# Altium project old_singleboard_now_mcu.PrjPcb (part 3 of 4)

## Sheet power.SchDoc
size 381 x 241 mm; SheetNumber: 2; SheetTotal: 5
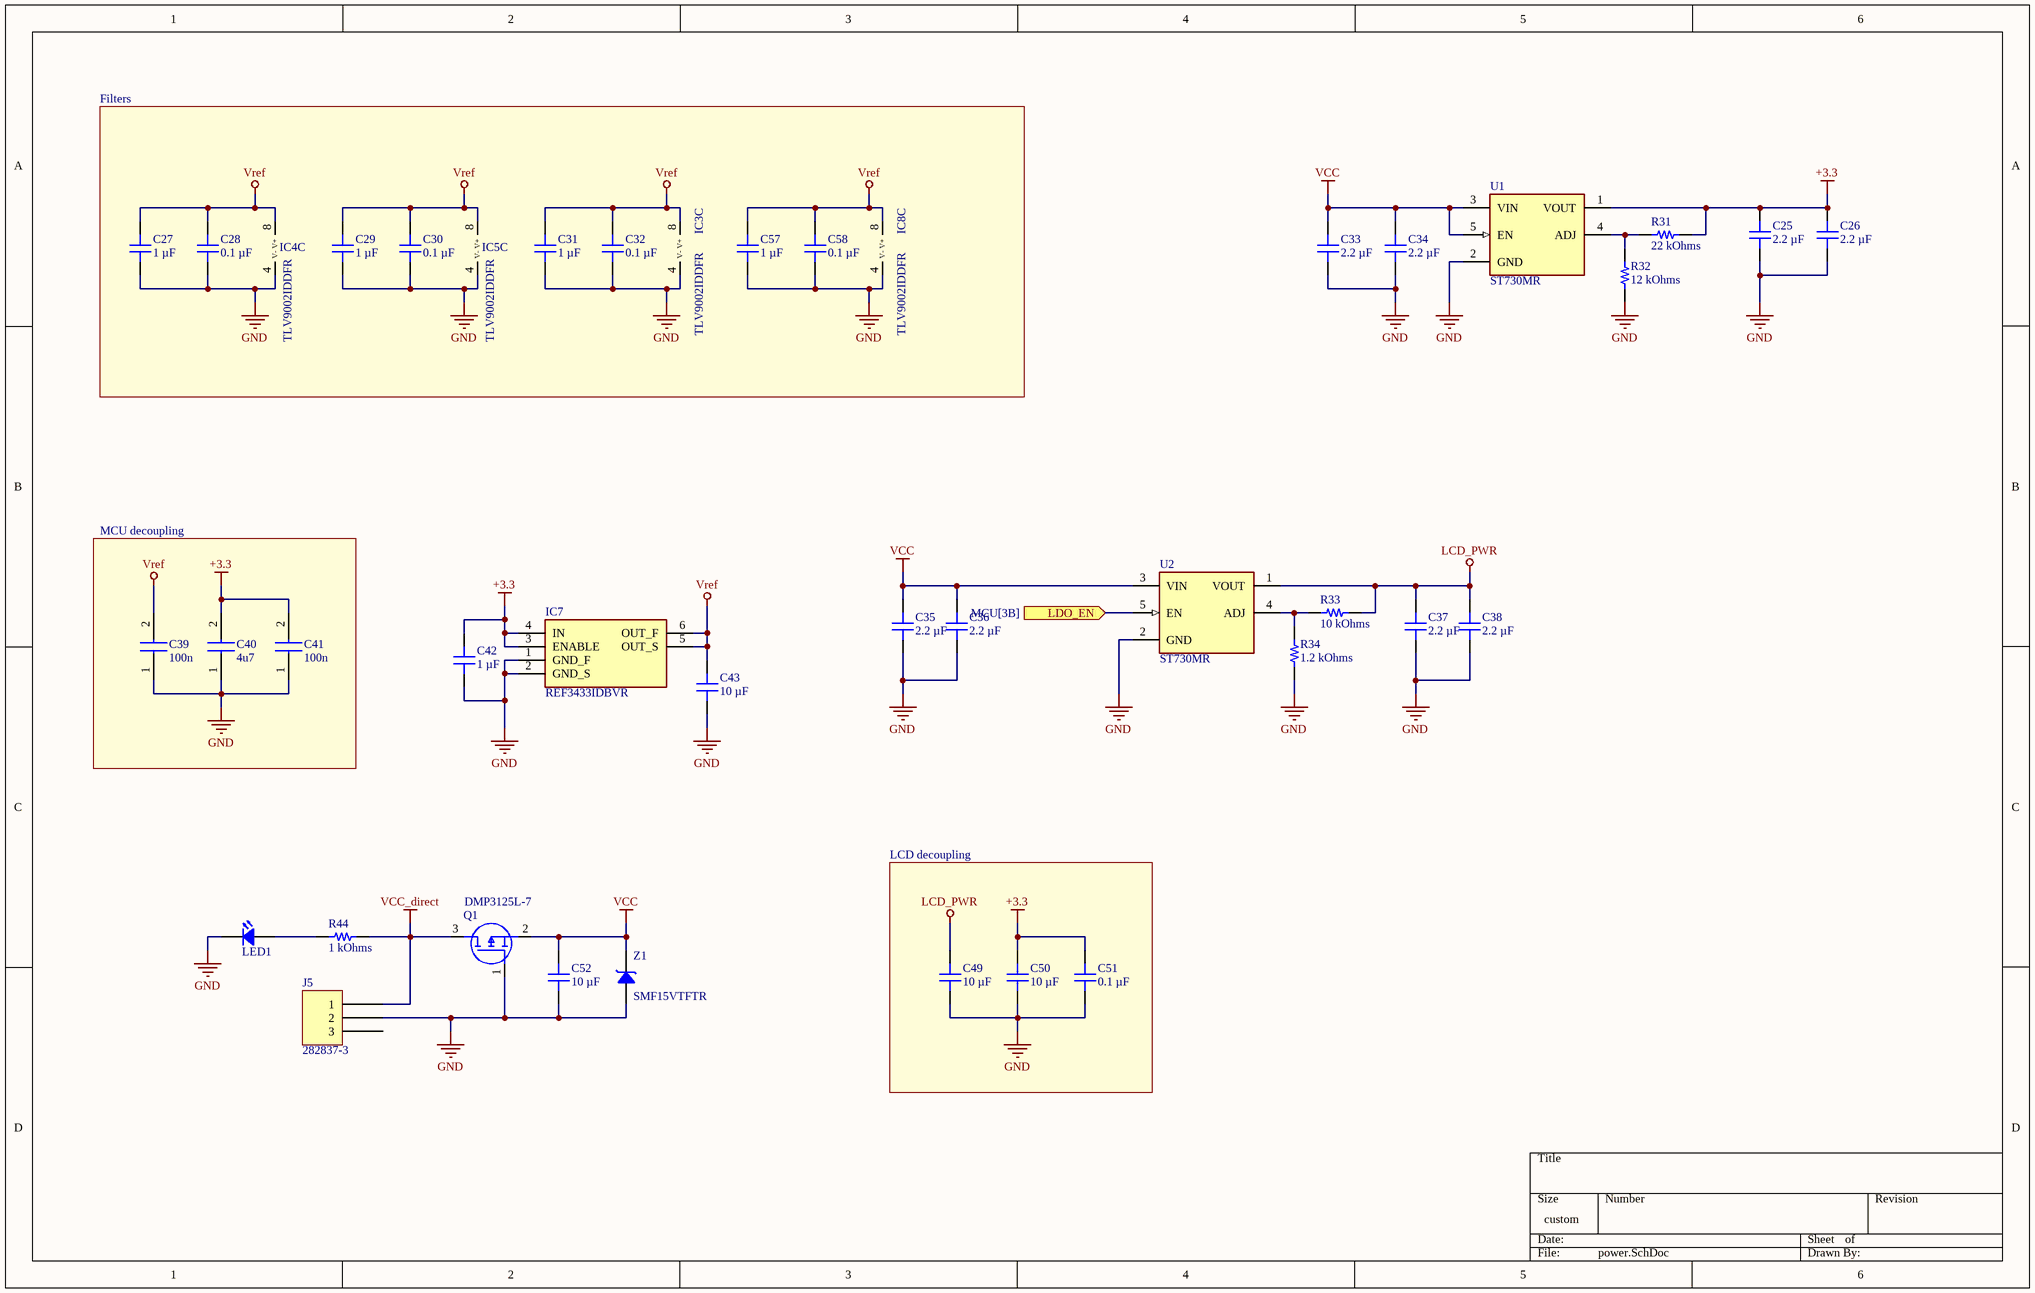
[diagram p5: power.SchDoc]

### Parts
(Parts that share a designator on the sheet are numbered #1, #2 ... from top to bottom, then left to right.)
C25#1  2.2 µF  [CAP 1206_3216 - 0.8MM]
C26#1  2.2 µF  [CAP 1206_3216 - 0.8MM]
C27#1  1 µF  [CAP 1206_3216 - 0.8MM]
C28#1  0.1 µF  [CAP 1206_3216 - 0.8MM]
C29#1  1 µF  [CAP 1206_3216 - 0.8MM]
C30#1  0.1 µF  [CAP 1206_3216 - 0.8MM]
C31#1  1 µF  [CAP 1206_3216 - 0.8MM]
C32#1  0.1 µF  [CAP 1206_3216 - 0.8MM]
C33#1  2.2 µF  [CAP 1206_3216 - 0.8MM]
C34#1  2.2 µF  [CAP 1206_3216 - 0.8MM]
C35#1  2.2 µF  [CAP 1206_3216 - 0.8MM]
C36#1  2.2 µF  [CAP 1206_3216 - 0.8MM]
C37#1  2.2 µF  [CAP 1206_3216 - 0.8MM]
C38#1  2.2 µF  [CAP 1206_3216 - 0.8MM]
C39  100n  [C0805]
C40  4u7  [C0805]
C41  100n  [C0805]
C42  1 µF  [CAP 1206_3216 - 0.8MM]
C43  10 µF  [CAP 1206_3216 - 0.8MM]
C49  10 µF  [CAP 1206_3216 - 0.8MM]
C50  10 µF  [CAP 1206_3216 - 0.8MM]
C51  0.1 µF  [CAP 1206_3216 - 0.8MM]
C52  10 µF  [CAP 1206_3216 - 0.8MM]
C57  1 µF  [CAP 1206_3216 - 0.8MM]
C58  0.1 µF  [CAP 1206_3216 - 0.8MM]
IC3  TLV9002IDDFR  [SOT65P280X110-8N]  (part C of 3)
IC4  TLV9002IDDFR  [SOT65P280X110-8N]  (part C of 3)
IC5  TLV9002IDDFR  [SOT65P280X110-8N]  (part C of 3)
IC7  REF3433IDBVR  [SOT95P280X145-6N]
IC8  TLV9002IDDFR  [SOT65P280X110-8N]  (part C of 3)
J5#2  282837-3  [TE 282837-3]
LED1  KR_EELP41.22-Q1S1-36-A8J8-020-R18  [KREELP4122Q1S136A8J8020R18]  (value not drawn)
Q1#2  DMP3125L-7  [SOT96P240X110-3N]
R31#2  22 kOhms  [YAGEO RES 1206_3216]
R32#2  12 kOhms  [YAGEO RES 1206_3216]
R33#2  10 kOhms  [YAGEO RES 1206_3216]
R34#2  1.2 kOhms  [YAGEO RES 1206_3216]
R44#2  1 kOhms  [YAGEO RES 1206_3216]
U1#2  ST730MR  [FP-UJ-5-IPC_B]
U2#2  ST730MR  [FP-UJ-5-IPC_B]
Z1  SMF15VTFTR  [SMF15VTFTR]

### Blocks framed on the sheet
Filters: C27#1 C28#1 C29#1 C30#1 C31#1 C32#1 C57 C58 IC3-IC5 IC8
MCU decoupling: C39-C41
LCD decoupling: C49-C51

### Ports
LDO_EN (in, see MCU[3B])

### Nets
+3.3: C25#1.2 C26#1.2 C40.2 C41.2 C42.2 C50.2 C51.2 IC7.3(ENABLE) IC7.4(IN) R31#2.2 U1#2.1(VOUT)
GND: C25#1.1 C26#1.1 C27#1.1 C28#1.1 C29#1.1 C30#1.1 C31#1.1 C32#1.1 C33#1.1 C34#1.1 C35#1.1 C36#1.1 C37#1.1 C38#1.1 C39.1 C40.1 C41.1 C42.1 C43.1 C49.1 C50.1 C51.1 C52.1 C57.1 C58.1 IC3.4(V-) IC4.4(V-) IC5.4(V-) IC7.1(GND_F) IC7.2(GND_S) IC8.4(V-) J5#2.2 LED1.1(K) Q1#2.1(G) R32#2.2 R34#2.2 U1#2.2(GND) U2#2.2(GND) Z1.2
LCD_PWR: C37#1.2 C38#1.2 C49.2 R33#2.2 U2#2.1(VOUT)
VCC: C33#1.2 C34#1.2 C35#1.2 C36#1.2 C52.2 Q1#2.2(S) U1#2.3(VIN) U1#2.5(EN) U2#2.3(VIN) Z1.1
VCC_direct: J5#2.1 Q1#2.3(D) R44#2.1
Vref: C27#1.2 C28#1.2 C29#1.2 C30#1.2 C31#1.2 C32#1.2 C39.2 C43.2 C57.2 C58.2 IC3.8(V+) IC4.8(V+) IC5.8(V+) IC7.5(OUT_S) IC7.6(OUT_F) IC8.8(V+)
LDO_EN: U2#2.5(EN) ; port LDO_EN
NetLED1_2: LED1.2(A) R44#2.2
NetR31#2_1: R31#2.1 R32#2.1 U1#2.4(ADJ)
NetR33#2_1: R33#2.1 R34#2.1 U2#2.4(ADJ)

Not connected (* = marked no-connect by the designer): J5#2 3

### Library data of the parts
C25#1 C26#1 C33#1 C34#1 C35#1 C36#1 C37#1 C38#1 = 885382208001: CAP CER 2.2UF 25V X7R 1206; manufacturer: Würth Elektronik; Tolerance: ±10%; Part Number: 885382208001; Capacitance: 2.2 µF; Applications: Boardflex Sensitive; componentlink2description: DigiKey Link; componentlink2url: https://www.digikey.com/en/products/detail/würth-elektronik/885382208001/9816354; Device Package: 1206 (3216 Metric); Features: Soft Termination; lastupdated: 6/4/2024 19:10:38; Lifecycle Status: Active; Minimum Order: 1; Mounting Type: Surface Mount, MLCC; Operating Temperature: -55°C ~ 125°C; Package / Case: 1206 (3216 Metric); packaging: TapeAndReel; partid: 45904; Part Status: Active; price: 0.35; series: WCAP-CSST; Size / Dimension: 0.126" L x 0.063" W (3.20mm x 1.60mm); Supplier 1: DigiKey; Supplier Part Number 1: 732-13199-1-ND; Temperature Coefficient: X7R; Thickness (Max): 0.083" (2.10mm); value: 2.2 µF; Voltage - Rated: 25V
C27#1 C29#1 C31#1 C42 C57 = 885012208093: CAP CER 1UF 50V X7R 1206; manufacturer: Würth Elektronik; Tolerance: ±10%; Part Number: 885012208093; Capacitance: 1 µF; Applications: General Purpose; componentlink1description: Datasheet; componentlink1url: https://katalog.we-online.de/pbs/datasheet/885012208093.pdf; componentlink2description: DigiKey Link; componentlink2url: https://www.digikey.com/en/products/detail/würth-elektronik/885012208093/5453432; Device Package: 1206 (3216 Metric); lastupdated: 6/4/2024 19:10:33; Lifecycle Status: Active; Minimum Order: 1; Mounting Type: Surface Mount, MLCC; Operating Temperature: -55°C ~ 125°C; Package / Case: 1206 (3216 Metric); packaging: TapeAndReel; partid: 39665; Part Status: Active; price: 0.10; series: WCAP-CSGP; Size / Dimension: 0.126" L x 0.063" W (3.20mm x 1.60mm); Supplier 1: DigiKey; Supplier Part Number 1: 732-7577-1-ND; Temperature Coefficient: X7R; Thickness (Max): 0.075" (1.90mm); value: 1 µF; Voltage - Rated: 50V
C28#1 C30#1 C32#1 C51 C58 = 885012208087: CAP CER 0.1UF 50V X7R 1206; manufacturer: Würth Elektronik; Tolerance: ±10%; Part Number: 885012208087; Capacitance: 0.1 µF; Applications: General Purpose; componentlink1description: Datasheet; componentlink1url: https://katalog.we-online.de/pbs/datasheet/885012208087.pdf; componentlink2description: DigiKey Link; componentlink2url: https://www.digikey.com/en/products/detail/würth-elektronik/885012208087/5453982; Device Package: 1206 (3216 Metric); lastupdated: 6/4/2024 19:10:27; Lifecycle Status: Active; Minimum Order: 1; Mounting Type: Surface Mount, MLCC; Operating Temperature: -55°C ~ 125°C; Package / Case: 1206 (3216 Metric); packaging: TapeAndReel; partid: 20879; Part Status: Active; price: 0.06; series: WCAP-CSGP; Size / Dimension: 0.126" L x 0.063" W (3.20mm x 1.60mm); Supplier 1: DigiKey; Supplier Part Number 1: 732-8127-1-ND; Temperature Coefficient: X7R; Thickness (Max): 0.035" (0.90mm); value: 0.1 µF; Voltage - Rated: 50V
C39 C41 = C0805C104K3RACTU: Capacitor; Manufacturer_Name: KEMET; Datasheet Link: https://content.kemet.com/datasheets/KEM_C1002_X7R_SMD.pdf; Height: 1.1mm; Manufacturer_Part_Number: C0805C104K3RACTU; Mouser Part Number: 80-C0805C104K3R; Mouser Price/Stock: https://www.mouser.co.uk/ProductDetail/KEMET/C0805C104K3RACTU?qs=zZwvocWqSRjmUvfNxkIN%2Fg%3D%3D; Arrow Part Number: C0805C104K3RACTU; Arrow Price/Stock: https://www.arrow.com/en/products/c0805c104k3ractu/kemet-corporation
C40 = C0805C475K9PAC: Capacitor; Manufacturer_Name: KEMET; Datasheet Link: https://componentsearchengine.com/Datasheets/2/C0805C475K8RACTU.pdf; Height: 1.4mm; Manufacturer_Part_Number: C0805C475K9PAC; Mouser Part Number: 80-C0805C475K9PAC; Mouser Price/Stock: https://www.mouser.co.uk/ProductDetail/KEMET/C0805C475K9PAC?qs=AHS6Mz2dKxNT7foClPNFpA%3D%3D; Arrow Part Number: C0805C475K9PAC; Arrow Price/Stock: https://www.arrow.com/en/products/c0805c475k9pac/kemet-corporation?region=nac
C43 C49 C50 C52 = 885012208069: CAP CER 10UF 25V X7R 1206; manufacturer: Würth Elektronik; Tolerance: ±10%; Part Number: 885012208069; Capacitance: 10 µF; Applications: General Purpose; componentlink1description: Datasheet; componentlink1url: https://katalog.we-online.de/pbs/datasheet/885012208069.pdf; componentlink2description: DigiKey Link; componentlink2url: https://www.digikey.com/en/products/detail/würth-elektronik/885012208069/5453429; Device Package: 1206 (3216 Metric); lastupdated: 6/4/2024 19:10:32; Lifecycle Status: Active; Minimum Order: 1; Mounting Type: Surface Mount, MLCC; Operating Temperature: -55°C ~ 125°C; Package / Case: 1206 (3216 Metric); packaging: TapeAndReel; partid: 43199; Part Status: Active; price: 0.40; series: WCAP-CSGP; Size / Dimension: 0.126" L x 0.063" W (3.20mm x 1.60mm); Supplier 1: DigiKey; Supplier Part Number 1: 732-7574-1-ND; Temperature Coefficient: X7R; Thickness (Max): 0.075" (1.90mm); value: 10 µF; Voltage - Rated: 25V
IC3-IC5 IC8 = TLV9002IDDFR: Integrated Circuit; Manufacturer_Name: Texas Instruments; Datasheet Link: https://www.ti.com/lit/gpn/TLV9002; Height: 1.1mm; Manufacturer_Part_Number: TLV9002IDDFR; Mouser Part Number: 595-TLV9002IDDFR; Mouser Price/Stock: https://www.mouser.co.uk/ProductDetail/Texas-Instruments/TLV9002IDDFR?qs=mAH9sUMRCtuVJ6NmNV%252Bgrw%3D%3D; Arrow Part Number: TLV9002IDDFR; Arrow Price/Stock: https://www.arrow.com/en/products/tlv9002iddfr/texas-instruments?utm_currency=USD&region=nac
IC7 = REF3433IDBVR: Integrated Circuit; Manufacturer_Name: Texas Instruments; Datasheet Link: http://www.ti.com/lit/ds/symlink/ref3433.pdf; Height: 1.45mm; Manufacturer_Part_Number: REF3433IDBVR; Mouser Part Number: 595-REF3433IDBVR; Mouser Price/Stock: https://www.mouser.co.uk/ProductDetail/Texas-Instruments/REF3433IDBVR?qs=W0yvOO0ixfGBJPqcMgjPbw%3D%3D; Arrow Part Number: REF3433IDBVR; Arrow Price/Stock: https://www.arrow.com/en/products/ref3433idbvr/texas-instruments?utm_currency=USD&region=nac
J5#2 = 282837-3: TERM BLK 3P SIDE ENT 5.08MM PCB; Manufacturer: TE Connectivity AMP Connectors; Current: 13.5 A; Mating Orientation: Horizontal with Board; Number of Levels: 1; Pitch: 0.200" (5.08mm); Positions Per Level: 3; Voltage: 300 V; Wire Gauge: 16-28 AWG; Wire Termination: Screw - Rising Cage Clamp; Part Number: 282837-3; Color: Green; ComponentLink1Description: Datasheet; ComponentLink1URL: https://www.te.com/commerce/DocumentDelivery/DDEController?Action=srchrtrv&DocNm=282837&DocType=Customer+Drawing&DocLang=English; ComponentLink2Description: DigiKey Link; ComponentLink2URL: https://www.digikey.com/en/products/detail/te-connectivity-amp-connectors/282837-3/2187974; Features: Interlocking (Side); LastUpdated: 6/21/2022 15:00:39; Lifecycle Status: Active; Minimum Order: 1; Mounting Type: Through Hole; Packaging: Tray; Part Status: Active; Price: 0.47; Series: Buchanan; Supplier 1: DigiKey; Supplier Part Number 1: A113321-ND
LED1 = KR_EELP41.22-Q1S1-36-A8J8-020-R18: LED; Manufacturer_Name: ams OSRAM; Manufacturer_Part_Number: KR EELP41.22-Q1S1-36-A8J8-020-R18; Datasheet Link: https://look.ams-osram.com/m/7eda7e8e2ca21691/original/KR-EELP41-22.pdf; Height: 0.5mm; Mouser Part Number: 720-P412Q1S136A8J802; Mouser Price/Stock: https://www.mouser.co.uk/ProductDetail/ams-OSRAM/KR-EELP41.22-Q1S1-36-A8J8-020-R18?qs=ZcfC38r4PouTxNZSRl%252Bn6g%3D%3D
Q1#2 = DMP3125L-7: MOSFET (P-Channel); Manufacturer_Name: Diodes Incorporated; Datasheet Link: https://www.diodes.com//assets/Datasheets/DMP3125L.pdf; Height: 1.1mm; Manufacturer_Part_Number: DMP3125L-7; Mouser Part Number: 621-DMP3125L-7; Mouser Price/Stock: https://www.mouser.co.uk/ProductDetail/Diodes-Incorporated/DMP3125L-7?qs=W0yvOO0ixfH8ma8MdHfXQA%3D%3D; Arrow Part Number: DMP3125L-7; Arrow Price/Stock: https://www.arrow.com/en/products/dmp3125l-7/diodes-incorporated?region=nac
R31#2 = RT1206FRE0722KL: RES SMD 22K OHM 1% 1/4W 1206; Manufacturer: Yageo; Power (Watts): 0.25W, 1/4W; Temperature Coefficient: ±50ppm/°C; Part Number: RT1206FRE0722KL; ComponentLink1Description: Datasheet; ComponentLink1URL: https://www.yageo.com/upload/media/product/productsearch/datasheet/rchip/PYu-RT_1-to-0.01_RoHS_L_12.pdf; ComponentLink2Description: DigiKey Link; ComponentLink2URL: https://www.digikey.com/en/products/detail/yageo/RT1206FRE0722KL/1083042; Composition: Thin Film; Device Package: 1206 (3216 Metric); Height - Seated (Max): 0.026" (0.65mm); LastUpdated: 7/25/2024 09:21:19; Lifecycle Status: Active; Minimum Order: 1; Number of Terminations: 2; Operating Temperature: -55°C ~ 155°C; Package / Case: 1206 (3216 Metric); Packaging: TapeAndReel; PartId: 69172; Price: 0.01; Resistance: 22 kOhms; Series: RT; Size / Dimension: 0.122" L x 0.063" W (3.10mm x 1.60mm); Supplier 1: DigiKey; Supplier Part Number 1: 13-RT1206FRE0722KLCT-ND; Supplier Device Package: 1206; Tolerance: ±1%; Value: 22 kOhms; Part Status: Active
R32#2 = RT1206FRE0712KL: RES SMD 12K OHM 1% 1/4W 1206; Manufacturer: Yageo; Power (Watts): 0.25W, 1/4W; Temperature Coefficient: ±50ppm/°C; Part Number: RT1206FRE0712KL; ComponentLink1Description: Datasheet; ComponentLink1URL: https://www.yageo.com/upload/media/product/productsearch/datasheet/rchip/PYu-RT_1-to-0.01_RoHS_L_12.pdf; ComponentLink2Description: DigiKey Link; ComponentLink2URL: https://www.digikey.com/en/products/detail/yageo/RT1206FRE0712KL/1082900; Composition: Thin Film; Device Package: 1206 (3216 Metric); Height - Seated (Max): 0.026" (0.65mm); LastUpdated: 7/25/2024 09:21:22; Lifecycle Status: Active; Minimum Order: 1; Number of Terminations: 2; Operating Temperature: -55°C ~ 155°C; Package / Case: 1206 (3216 Metric); Packaging: TapeAndReel; PartId: 58377; Part Status: Active; Price: 0.01; Resistance: 12 kOhms; Series: RT; Size / Dimension: 0.122" L x 0.063" W (3.10mm x 1.60mm); Supplier 1: DigiKey; Supplier Part Number 1: 13-RT1206FRE0712KLCT-ND; Supplier Device Package: 1206; Tolerance: ±1%; Value: 12 kOhms
R33#2 = RT1206FRE0710KL: RES SMD 10K OHM 1% 1/4W 1206; Manufacturer: Yageo; Power (Watts): 0.25W, 1/4W; Temperature Coefficient: ±50ppm/°C; Part Number: RT1206FRE0710KL; ComponentLink1Description: Datasheet; ComponentLink1URL: https://www.yageo.com/upload/media/product/productsearch/datasheet/rchip/PYu-RT_1-to-0.01_RoHS_L_11.pdf; ComponentLink2Description: DigiKey Link; ComponentLink2URL: https://www.digikey.com/en/products/detail/yageo/RT1206FRE0710KL/1082868; Composition: Thin Film; Device Package: 1206 (3216 Metric); Height - Seated (Max): 0.026" (0.65mm); LastUpdated: 7/25/2024 09:21:28; Lifecycle Status: Active; Minimum Order: 1; Number of Terminations: 2; Operating Temperature: -55°C ~ 155°C; Package / Case: 1206 (3216 Metric); Packaging: TapeAndReel; PartId: 38903; Part Status: Active; Price: 0.01; Resistance: 10 kOhms; Series: RT; Size / Dimension: 0.122" L x 0.063" W (3.10mm x 1.60mm); Supplier 1: DigiKey; Supplier Part Number 1: YAG1242CT-ND; Supplier Device Package: 1206; Tolerance: ±1%; Value: 10 kOhms
R34#2 = RT1206FRE071K2L: RES SMD 1.2K OHM 1% 1/4W 1206; Manufacturer: Yageo; Power (Watts): 0.25W, 1/4W; Temperature Coefficient: ±50ppm/°C; Part Number: RT1206FRE071K2L; ComponentLink1Description: Datasheet; ComponentLink1URL: https://www.yageo.com/upload/media/product/productsearch/datasheet/rchip/PYu-RT_1-to-0.01_RoHS_L_12.pdf; ComponentLink2Description: DigiKey Link; ComponentLink2URL: https://www.digikey.com/en/products/detail/yageo/RT1206FRE071K2L/1082995; Composition: Thin Film; Device Package: 1206 (3216 Metric); Height - Seated (Max): 0.026" (0.65mm); LastUpdated: 7/25/2024 09:21:22; Lifecycle Status: Active; Minimum Order: 1; Number of Terminations: 2; Operating Temperature: -55°C ~ 155°C; Package / Case: 1206 (3216 Metric); Packaging: TapeAndReel; PartId: 58383; Part Status: Active; Price: 0.01; Resistance: 1.2 kOhms; Series: RT; Size / Dimension: 0.122" L x 0.063" W (3.10mm x 1.60mm); Supplier 1: DigiKey; Supplier Part Number 1: 13-RT1206FRE071K2LCT-ND; Supplier Device Package: 1206; Tolerance: ±1%; Value: 1.2 kOhms
R44#2 = RT1206FRE071KL: RES SMD 1K OHM 1% 1/4W 1206; Manufacturer: Yageo; Power (Watts): 0.25W, 1/4W; Temperature Coefficient: ±50ppm/°C; Part Number: RT1206FRE071KL; ComponentLink1Description: Datasheet; ComponentLink1URL: https://www.yageo.com/upload/media/product/productsearch/datasheet/rchip/PYu-RT_1-to-0.01_RoHS_L_11.pdf; ComponentLink2Description: DigiKey Link; ComponentLink2URL: https://www.digikey.com/en/products/detail/yageo/RT1206FRE071KL/1083016; Composition: Thin Film; Device Package: 1206 (3216 Metric); Height - Seated (Max): 0.026" (0.65mm); LastUpdated: 7/25/2024 09:21:27; Lifecycle Status: Active; Minimum Order: 1; Number of Terminations: 2; Operating Temperature: -55°C ~ 155°C; Package / Case: 1206 (3216 Metric); Packaging: TapeAndReel; PartId: 40465; Part Status: Active; Price: 0.01; Resistance: 1 kOhms; Series: RT; Size / Dimension: 0.122" L x 0.063" W (3.10mm x 1.60mm); Supplier 1: DigiKey; Supplier Part Number 1: YAG3366CT-ND; Supplier Device Package: 1206; Tolerance: ±1%; Value: 1 kOhms
Z1 = SMF15VTFTR: Zener Diode; Manufacturer_Name: ROHM Semiconductor; Datasheet Link: https://fscdn.rohm.com/en/products/databook/datasheet/discrete/diode/zener/smf15vtftr-e.pdf; Height: 0.9mm; Manufacturer_Part_Number: SMF15VTFTR; Mouser Part Number: 755-SMF15VTFTR; Mouser Price/Stock: https://www.mouser.co.uk/ProductDetail/ROHM-Semiconductor/SMF15VTFTR?qs=HXFqYaX1Q2wU8NS9uLe0xg%3D%3D

## Sheet MCU.SchDoc
size A; SheetNumber: 3; SheetTotal: 5
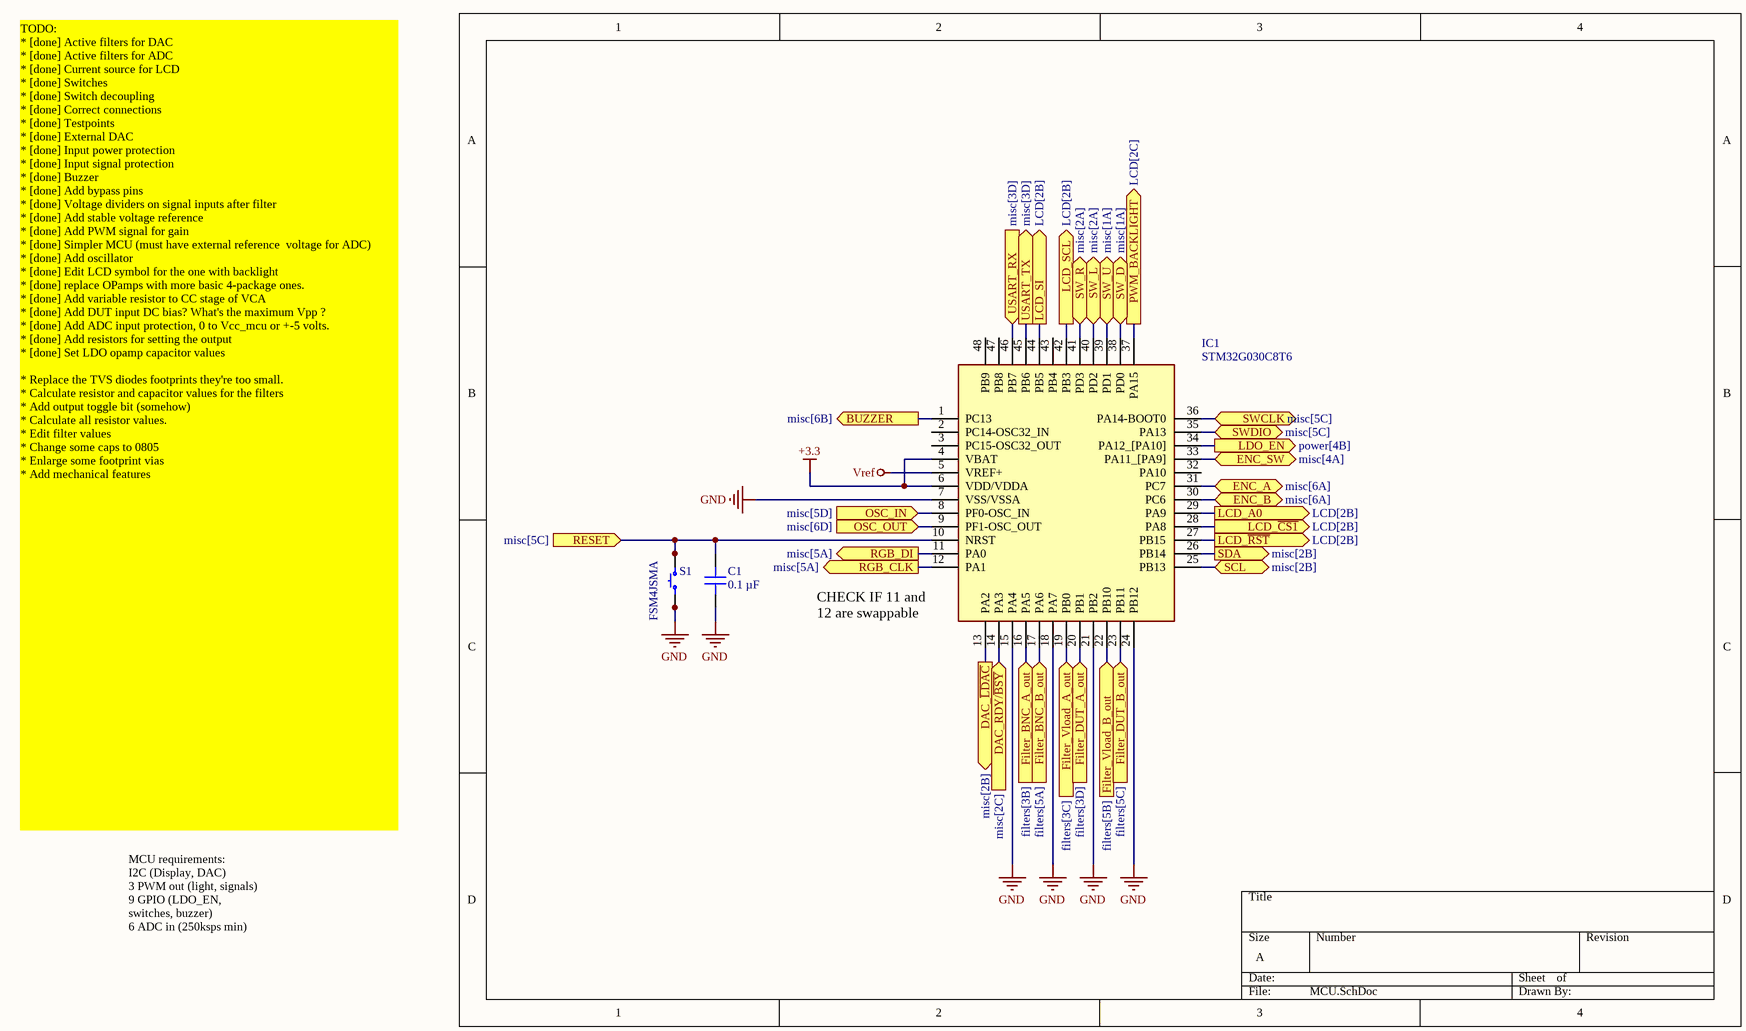
[diagram p6: MCU.SchDoc]

### Parts
(Parts that share a designator on the sheet are numbered #1, #2 ... from top to bottom, then left to right.)
C1#2  0.1 µF  [CAP 1206_3216 - 0.8MM]
IC1  STM32G030C8T6  [QFP50P900X900X160-48N]
S1  FSM4JSMA  [TE FSM4JSMA]

### Ports
BUZZER (out, see misc[6B]), DAC_RDY/~{BSY} (in, see misc[2C]), DAC_~{LDAC} (out, see misc[2B]), ENC_A (bidir, see misc[6A]), ENC_B (bidir, see misc[6A]), ENC_SW (bidir, see misc[4A]), Filter_BNC_A_out (in, see filters[3B]), Filter_BNC_B_out (in, see filters[5A]), Filter_DUT_A_out (in, see filters[3D]), Filter_DUT_B_out (in, see filters[5C]), Filter_Vload_A_out (in, see filters[3C]), Filter_Vload_B_out (in, see filters[5B]), LCD_A0 (out, see LCD[2B]), LCD_SCL (out, see LCD[2B]), LCD_SI (out, see LCD[2B]), LCD_~{CS1} (out, see LCD[2B]), LCD_~{RST} (out, see LCD[2B]), LDO_EN (out, see power[4B]), OSC_IN (in, see misc[5D]), OSC_OUT (in, see misc[6D]), PWM_BACKLIGHT (out, see LCD[2C]), RESET (in, see misc[5C]), RGB_CLK (out, see misc[5A]), RGB_DI (out, see misc[5A]), SCL (bidir, see misc[2B]), SDA (out, see misc[2B]), SW_D (bidir, see misc[1A]), SW_L (bidir, see misc[2A]), SW_R (bidir, see misc[2A]), SW_U (bidir, see misc[1A]), SWCLK (bidir, see misc[5C]), SWDIO (bidir, see misc[5C]), USART_RX (in, see misc[3D]), USART_TX (out, see misc[3D])

### Nets
+3.3: IC1.4(VBAT) IC1.6(VDD/VDDA)
GND: C1#2.1 IC1.7(VSS/VSSA) IC1.15(PA4) IC1.18(PA7) IC1.21(PB2) IC1.24(PB12) S1.1 S1.2
Vref: IC1.5(VREF+)
LCD~{_CS}1: IC1.28(PA8) ; port LCD_~{CS1}
LCD~{_RS}T: IC1.27(PB15) ; port LCD_~{RST}
LCD_A0: IC1.29(PA9) ; port LCD_A0
LCD_SCL: IC1.42(PB3) ; port LCD_SCL
LCD_SI: IC1.44(PB5) ; port LCD_SI
LDO_EN: IC1.34(PA12_[PA10]) ; port LDO_EN
NetC1#2_2: C1#2.2 IC1.10(NRST) S1.3 S1.4 ; port RESET
NetC2#2_2: IC1.30(PC6) ; port ENC_B
NetC3_2: IC1.31(PC7) ; port ENC_A
NetC6_1: IC1.8(PF0-OSC_IN) ; port OSC_IN
NetC7#2_2: IC1.9(PF1-OSC_OUT) ; port OSC_OUT
NetC8#1_1: IC1.17(PA6) ; port Filter_BNC_B_out
NetC10_1: IC1.16(PA5) ; port Filter_BNC_A_out
NetC12_1: IC1.22(PB10) ; port Filter_Vload_B_out
NetC14_1: IC1.19(PB0) ; port Filter_Vload_A_out
NetC16_1: IC1.23(PB11) ; port Filter_DUT_B_out
NetC18_1: IC1.20(PB1) ; port Filter_DUT_A_out
NetC44_2: IC1.38(PD0) ; port SW_D
NetC45_2: IC1.39(PD1) ; port SW_U
NetC46#2_2: IC1.41(PD3) ; port SW_R
NetC47#2_2: IC1.40(PD2) ; port SW_L
NetC48_2: IC1.33(PA11_[PA9]) ; port ENC_SW
NetIC1_1: IC1.1(PC13) ; port BUZZER
NetIC1_11: IC1.11(PA0) ; port RGB_DI
NetIC1_12: IC1.12(PA1) ; port RGB_CLK
NetIC1_13: IC1.13(PA2) ; port DAC_~{LDAC}
NetIC1_14: IC1.14(PA3) ; port DAC_RDY/~{BSY}
NetIC1_25: IC1.25(PB13) ; port SCL
NetIC1_26: IC1.26(PB14) ; port SDA
NetIC1_35: IC1.35(PA13) ; port SWDIO
NetIC1_36: IC1.36(PA14-BOOT0) ; port SWCLK
NetIC1_37: IC1.37(PA15) ; port PWM_BACKLIGHT
NetIC1_45: IC1.45(PB6) ; port USART_TX
NetIC1_46: IC1.46(PB7) ; port USART_RX

Not connected (* = marked no-connect by the designer): IC1 2(PC14-OSC32_IN) 3(PC15-OSC32_OUT) 32(PA10) 43(PB4) 47(PB8) 48(PB9)

### Notes on the sheet
- (near IC1) CHECK IF 11 and 12 are swappable
- TODO:
  * [done] Active filters for DAC
  * [done] Active filters for ADC
  * [done] Current source for LCD
  * [done] Switches
  * [done] Switch decoupling
  * [done] Correct connections
  * [done] Testpoints
  * [done] External DAC
  * [done] Input power protection
  * [done] Input signal protection
  * [done] Buzzer
  * [done] Add bypass pins
  * [done] Voltage dividers on signal inputs after filter
  * [done] Add stable voltage reference
  * [done] Add PWM signal for gain
  * [done] Simpler MCU (must have external reference  voltage for ADC)
  * [done] Add oscillator
  * [done] Edit LCD symbol for the one with backlight
  * [done] replace OPamps with more basic 4-package ones.
  * [done] Add variable resistor to CC stage of VCA
  * [done] Add DUT input DC bias? What's the maximum Vpp ?
  * [done] Add ADC input protection, 0 to Vcc_mcu or +-5 volts.
  * [done] Add resistors for setting the output
  * [done] Set LDO opamp capacitor values
  * Replace the TVS diodes footprints they're too small.
  * Calculate resistor and capacitor values for the filters
  * Add output toggle bit (somehow)
  * Calculate all resistor values.
  * Edit filter values
  * Change some caps to 0805
  * Enlarge some footprint vias
  * Add mechanical features
- MCU requirements:
  I2C (Display, DAC)
  3 PWM out (light, signals)
  9 GPIO (LDO_EN, switches, buzzer)
  6 ADC in (250ksps min)

### Library data of the parts
C1#2 = 885012208087: as C28#1 on sheet power; Part Number: 885012208087; Capacitance: 0.1 µF; Applications: General Purpose; componentlink1description: Datasheet; componentlink1url: https://katalog.we-online.de/pbs/datasheet/885012208087.pdf; componentlink2description: DigiKey Link; componentlink2url: https://www.digikey.com/en/products/detail/würth-elektronik/885012208087/5453982; Device Package: 1206 (3216 Metric); lastupdated: 6/4/2024 19:10:27; Lifecycle Status: Active; Minimum Order: 1; Mounting Type: Surface Mount, MLCC; Operating Temperature: -55°C ~ 125°C; Package / Case: 1206 (3216 Metric); packaging: TapeAndReel; partid: 20879; Part Status: Active; price: 0.06; series: WCAP-CSGP; Size / Dimension: 0.126" L x 0.063" W (3.20mm x 1.60mm); Supplier 1: DigiKey; Supplier Part Number 1: 732-8127-1-ND; Temperature Coefficient: X7R; Thickness (Max): 0.035" (0.90mm); value: 0.1 µF; Voltage - Rated: 50V
IC1 = STM32G030C8T6: Integrated Circuit; Manufacturer_Name: STMicroelectronics; Datasheet Link: https://componentsearchengine.com/Datasheets/1/STM32G030C8T6.pdf; Height: 1.6mm; Manufacturer_Part_Number: STM32G030C8T6; Mouser Part Number: 511-STM32G030C8T6; Mouser Price/Stock: https://www.mouser.co.uk/ProductDetail/STMicroelectronics/STM32G030C8T6?qs=uwxL4vQweFMKBA8wRRkiWA%3D%3D; Arrow Part Number: STM32G030C8T6; Arrow Price/Stock: https://www.arrow.com/en/products/stm32g030c8t6/stmicroelectronics?utm_currency=USD&region=nac
S1 = FSM4JSMA: SWITCH TACTILE SPST-NO 0.05A 24V; Manufacturer: TE Connectivity ALCOSWITCH Switches; Actuator Height off PCB, Vertical: 5.00mm; Actuator Orientation: Top Actuated; Actuator Type: Standard; Contact Rating @ Voltage: 0.05A @ 24VDC; Illumination: Non-Illuminated; Operating Force: 160gf; Outline: 6.00mm x 6.00mm; Switch Function: Off-Mom; Part Number: FSM4JSMA; Circuit: SPST-NO; ComponentLink1Description: Datasheet; ComponentLink1URL: https://www.te.com/commerce/DocumentDelivery/DDEController?Action=srchrtrv&DocNm=1308111-1_SWITCHES_CORE_PROGRAM_CATALOG&DocType=CS&DocLang=English; ComponentLink2Description: DigiKey Link; ComponentLink2URL: https://www.digikey.com/en/products/detail/te-connectivity-alcoswitch-switches/FSM4JSMA/525821; LastUpdated: 6/3/2024 20:19:31; Lifecycle Status: Active; Minimum Order: 1; Mounting Type: Surface Mount; Operating Temperature: -35°C ~ 85°C; Packaging: Bulk; Part Status: Active; Price: 0.14; Series: FSMJSMA; Supplier 1: DigiKey; Supplier Part Number 1: 450-1129-ND; Termination Style: Gull Wing

## Sheet LDO.SchDoc
size 381 x 241 mm; SheetNumber: 8; SheetTotal: 12
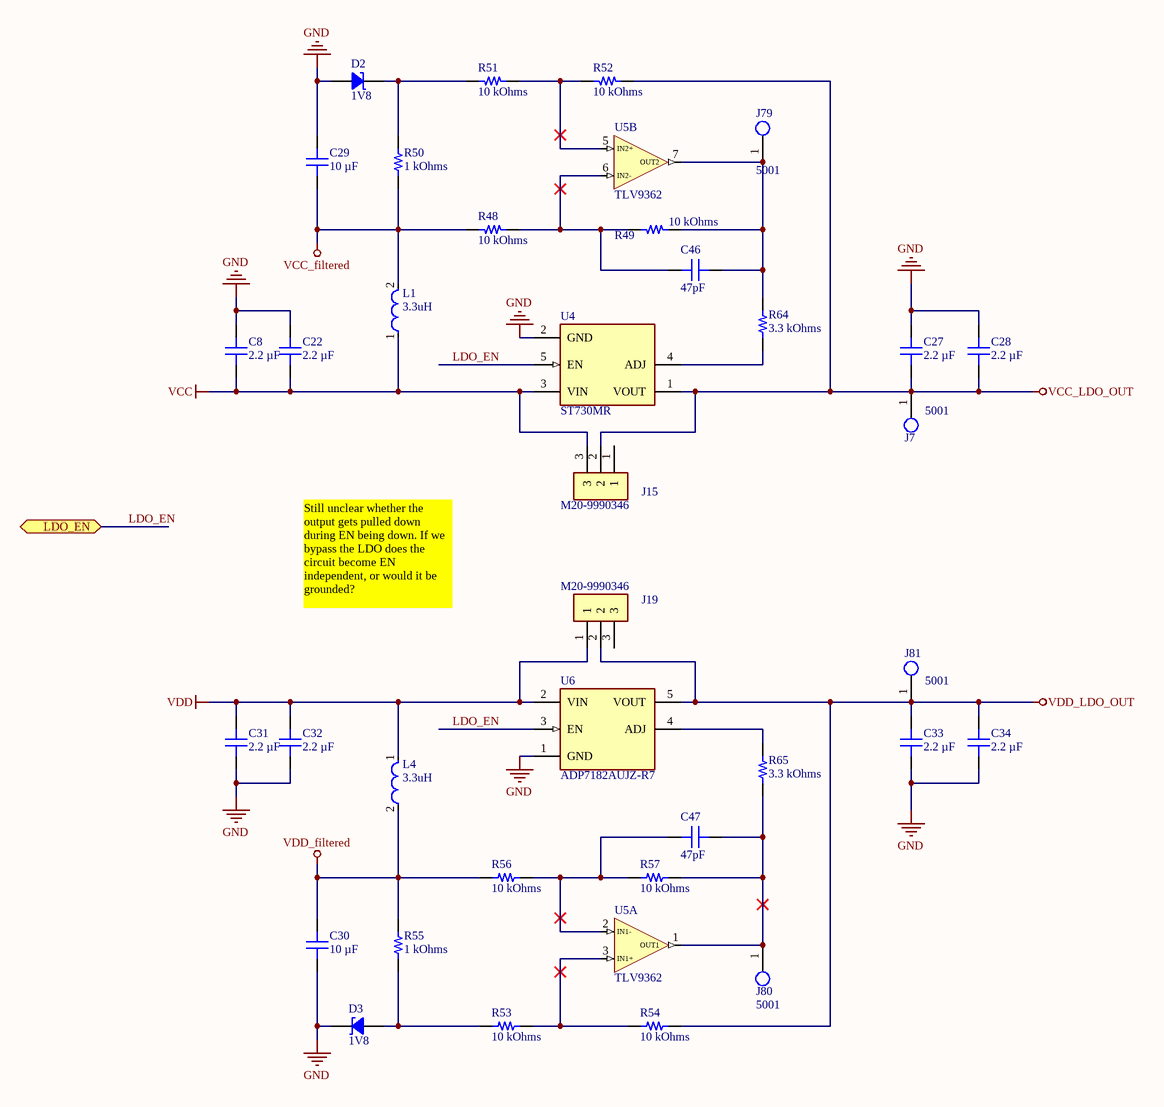
[diagram p7: LDO.SchDoc]

### Parts
(Parts that share a designator on the sheet are numbered #1, #2 ... from top to bottom, then left to right.)
C8#2  2.2 µF  [CAP 1206_3216 - 0.8MM]
C22#1  2.2 µF  [CAP 1206_3216 - 0.8MM]
C27#2  2.2 µF  [CAP 1206_3216 - 0.8MM]
C28#2  2.2 µF  [CAP 1206_3216 - 0.8MM]
C29#2  10 µF  [CAP 1206_3216 - 0.8MM]
C30#2  10 µF  [CAP 1206_3216 - 0.8MM]
C31#2  2.2 µF  [CAP 1206_3216 - 0.8MM]
C32#2  2.2 µF  [CAP 1206_3216 - 0.8MM]
C33#2  2.2 µF  [CAP 1206_3216 - 0.8MM]
C34#2  2.2 µF  [CAP 1206_3216 - 0.8MM]
C46#1  47pF  [CAP 1206_3216 - 1.8MM]
C47#1  47pF  [CAP 1206_3216 - 1.8MM]
D2#1  1V8  [SOD323]
D3#2  1V8  [SOD323]
J7  5001  [FP-5001-MFG]
J15  M20-9990346  [HDRV3W64P0X254_1X3_762X254X864P]
J19  M20-9990346  [HDRV3W64P0X254_1X3_762X254X864P]
J79  5001  [FP-5001-MFG]
J80  5001  [FP-5001-MFG]
J81  5001  [FP-5001-MFG]
L1  3.3uH  [FP-MLZ2012-1_25-IPC_B]
L4  3.3uH  [FP-MLZ2012-1_25-IPC_B]
R48  10 kOhms  [YAGEO RES 1206_3216]
R49  10 kOhms  [YAGEO RES 1206_3216]
R50  1 kOhms  [YAGEO RES 1206_3216]
R51  10 kOhms  [YAGEO RES 1206_3216]
R52  10 kOhms  [YAGEO RES 1206_3216]
R53  10 kOhms  [YAGEO RES 1206_3216]
R54  10 kOhms  [YAGEO RES 1206_3216]
R55  1 kOhms  [YAGEO RES 1206_3216]
R56  10 kOhms  [YAGEO RES 1206_3216]
R57  10 kOhms  [YAGEO RES 1206_3216]
R64  3.3 kOhms  [YAGEO RES 1206_3216]
R65  3.3 kOhms  [YAGEO RES 1206_3216]
U4  ST730MR  [FP-UJ-5-IPC_B]
U5  TLV9362  [SOIC8-127P600X175-8N]  (parts A,B of 3)
U6  ADP7182AUJZ-R7  [FP-UJ-5-IPC_B]

### Ports
LDO_EN (bidir, see MCU[4B], power[3D])

### Nets
GND: C8#2.1 C22#1.1 C27#2.1 C28#2.1 C29#2.1 C30#2.1 C31#2.1 C32#2.1 C33#2.1 C34#2.1 D2#1.1 D3#2.2 U4.2(GND) U6.1(GND)
VCC: C8#2.2 C22#1.2 J15.3 L1.1 U4.3(VIN)
VCC_filtered: C29#2.2 L1.2 R48.2 R50.1
VCC_LDO_OUT: C27#2.2 C28#2.2 J7.1 J15.2 R52.1 U4.1(VOUT)
VDD: C31#2.2 C32#2.2 J19.1 L4.1 U6.2(VIN)
VDD_filtered: C30#2.2 L4.2 R55.2 R56.2
VDD_LDO_OUT: C33#2.2 C34#2.2 J19.2 J81.1 R54.1 U6.5(VOUT)
LDO_EN: U4.5(EN) U6.3(EN) ; port LDO_EN
NetC46#1_1: C46#1.1 R48.1 R49.2 U5.6(IN2-)
NetC46#1_2: C46#1.2 J79.1 R49.1 R64.1 U5.7(OUT2)
NetC47#1_1: C47#1.1 R56.1 R57.2 U5.2(IN1-)
NetC47#1_2: C47#1.2 J80.1 R57.1 R65.2 U5.1(OUT1)
NetD2#1_2: D2#1.2 R50.2 R51.2
NetD3#2_1: D3#2.1 R53.2 R55.1
NetR51_1: R51.1 R52.2 U5.5(IN2+)
NetR53_1: R53.1 R54.2 U5.3(IN1+)
NetR64_2: R64.2 U4.4(ADJ)
NetR65_1: R65.1 U6.4(ADJ)

Not connected (* = marked no-connect by the designer): J15 1; J19 3

### Notes on the sheet
- Still unclear whether the output gets pulled down during EN being down. If we bypass the LDO does the circuit become EN independent, or would it be grounded?
- Type @ to refer to a designator or a net

### Library data of the parts
C8#2 C22#1 C27#2 C28#2 C31#2 C32#2 C33#2 C34#2 = 885382208001: as C25#1 on sheet power; Part Number: 885382208001; Capacitance: 2.2 µF; Applications: Boardflex Sensitive; componentlink2description: DigiKey Link; componentlink2url: https://www.digikey.com/en/products/detail/würth-elektronik/885382208001/9816354; Device Package: 1206 (3216 Metric); Features: Soft Termination; lastupdated: 6/4/2024 19:10:38; Lifecycle Status: Active; Minimum Order: 1; Mounting Type: Surface Mount, MLCC; Operating Temperature: -55°C ~ 125°C; Package / Case: 1206 (3216 Metric); packaging: TapeAndReel; partid: 45904; Part Status: Active; price: 0.35; series: WCAP-CSST; Size / Dimension: 0.126" L x 0.063" W (3.20mm x 1.60mm); Supplier 1: DigiKey; Supplier Part Number 1: 732-13199-1-ND; Temperature Coefficient: X7R; Thickness (Max): 0.083" (2.10mm); value: 2.2 µF; Voltage - Rated: 25V
C29#2 C30#2 = 885012208069: as C43 on sheet power; Part Number: 885012208069; Capacitance: 10 µF; Applications: General Purpose; componentlink1description: Datasheet; componentlink1url: https://katalog.we-online.de/pbs/datasheet/885012208069.pdf; componentlink2description: DigiKey Link; componentlink2url: https://www.digikey.com/en/products/detail/würth-elektronik/885012208069/5453429; Device Package: 1206 (3216 Metric); lastupdated: 6/4/2024 19:10:32; Lifecycle Status: Active; Minimum Order: 1; Mounting Type: Surface Mount, MLCC; Operating Temperature: -55°C ~ 125°C; Package / Case: 1206 (3216 Metric); packaging: TapeAndReel; partid: 43199; Part Status: Active; price: 0.40; series: WCAP-CSGP; Size / Dimension: 0.126" L x 0.063" W (3.20mm x 1.60mm); Supplier 1: DigiKey; Supplier Part Number 1: 732-7574-1-ND; Temperature Coefficient: X7R; Thickness (Max): 0.075" (1.90mm); value: 10 µF; Voltage - Rated: 25V
C46#1 C47#1 = 1206AA470KAT1A: CAP CER 47PF 1KV C0G/NP0 1206; manufacturer: AVX Corporation; Temperature Coefficient: C0G, NP0; Tolerance: ±10%; Voltage - Rated: 1000V (1kV); Part Number: 1206AA470KAT1A; Capacitance: 47pF; Applications: General Purpose; componentlink1description: Datasheet; componentlink1url: http://datasheets.avx.com/AVX-HV_MLCC.pdf; componentlink2description: DigiKey Link; componentlink2url: http://digikey.com/product-detail/en/avx-corporation/1206AA470KAT1A/478-2949-1-ND/808148; Device Package: 1206 (3216 Metric); Features: High Voltage; lastupdated: 9/2/2020 01:05:31; Lifecycle Status: Active; Minimum Order: 1; Mounting Type: Surface Mount, MLCC; Operating Temperature: -55°C ~ 125°C; Package / Case: 1206 (3216 Metric); packaging: TapeAndReel; partid: 21825; Part Status: Active; price: 0.11; series: -; Size / Dimension: 0.130" L x 0.063" W (3.30mm x 1.60mm); Supplier 1: DigiKey; Supplier Part Number 1: 478-2949-1-ND; Thickness (Max): 0.071" (1.80mm); value: 47pF
D2#1 D3#2 = BZX38450-C1V8X
J7 J79-J81 = CMP-2000-05181-2: PC TEST POINT MINIATURE BLACK; Body Material: Bronze; Plating: Silver; Inside Diameter: 1.27mm; Hole Diameter: 1.6mm; Number of Ports: 1; Outside Diameter: 2.54mm; Insulation: Insulated; Insulation Material: Nylon; Mount: Through Hole; RoHS Compliant: Yes; Series: THM; Height: 0.3inch; Termination: Through Hole; Material: Nylon; Packaging: Bulk; Contact Material: Bronze; REACH SVHC: No SVHC; Contact Plating: Silver; Orientation: Straight; Lead Free: Lead Free; Package Quantity: 100; Length: 7.62mm; Flammability Rating: UL94 V-0; Number of Contacts: 1; Diameter: 2.54mm; Housing Color: Black; Color: Black
J15 J19 = M20-9990346: Connector; Manufacturer_Name: Harwin; Datasheet Link: https://cdn.harwin.com/pdfs/M20-999.pdf; Height: 8.64mm; Manufacturer_Part_Number: M20-9990346; Mouser Part Number: 855-M20-9990346; Mouser Price/Stock: https://www.mouser.co.uk/ProductDetail/Harwin/M20-9990346?qs=ulE8k0yEMYbyhQ3uXpFs8Q%3D%3D
L1 L4 = MLZ2012M: Shielded Multilayer Inductor 3.3uH ±20% 500mA 260mΩ SMD 0805; Saturation Current: 350mA; Core Material: Ferrite; DC Resistance (DCR): 260mR; RoHS Compliant: Yes; Mount: Surface Mount; Case Code (Metric): 2012; Case/Package: 0805; Min Operating Temperature: -55°C; Package Quantity: 2000; Shielding: Shielded; Current Rating: 500mA; Height - Seated (Max): 0.057inch; Case Code (Imperial): 0805; Width: 0.049inch; Tolerance: 20%; Packaging: Tape and Reel; Inductance: 3.3uH; Lead Free: Lead Free; Max Operating Temperature: 125°C; Length: 0.079inch; Value: 3.3uH
R48 R49 R51-R54 R56 R57 = RT1206FRE0710KL: as R33#2 on sheet power; Part Number: RT1206FRE0710KL; ComponentLink1Description: Datasheet; ComponentLink1URL: https://www.yageo.com/upload/media/product/productsearch/datasheet/rchip/PYu-RT_1-to-0.01_RoHS_L_11.pdf; ComponentLink2Description: DigiKey Link; ComponentLink2URL: https://www.digikey.com/en/products/detail/yageo/RT1206FRE0710KL/1082868; Composition: Thin Film; Device Package: 1206 (3216 Metric); Height - Seated (Max): 0.026" (0.65mm); LastUpdated: 7/25/2024 09:21:28; Lifecycle Status: Active; Minimum Order: 1; Number of Terminations: 2; Operating Temperature: -55°C ~ 155°C; Package / Case: 1206 (3216 Metric); Packaging: TapeAndReel; PartId: 38903; Part Status: Active; Price: 0.01; Resistance: 10 kOhms; Series: RT; Size / Dimension: 0.122" L x 0.063" W (3.10mm x 1.60mm); Supplier 1: DigiKey; Supplier Part Number 1: YAG1242CT-ND; Supplier Device Package: 1206; Tolerance: ±1%; Value: 10 kOhms
R50 R55 = RT1206FRE071KL: as R44#2 on sheet power; Part Number: RT1206FRE071KL; ComponentLink1Description: Datasheet; ComponentLink1URL: https://www.yageo.com/upload/media/product/productsearch/datasheet/rchip/PYu-RT_1-to-0.01_RoHS_L_11.pdf; ComponentLink2Description: DigiKey Link; ComponentLink2URL: https://www.digikey.com/en/products/detail/yageo/RT1206FRE071KL/1083016; Composition: Thin Film; Device Package: 1206 (3216 Metric); Height - Seated (Max): 0.026" (0.65mm); LastUpdated: 7/25/2024 09:21:27; Lifecycle Status: Active; Minimum Order: 1; Number of Terminations: 2; Operating Temperature: -55°C ~ 155°C; Package / Case: 1206 (3216 Metric); Packaging: TapeAndReel; PartId: 40465; Part Status: Active; Price: 0.01; Resistance: 1 kOhms; Series: RT; Size / Dimension: 0.122" L x 0.063" W (3.10mm x 1.60mm); Supplier 1: DigiKey; Supplier Part Number 1: YAG3366CT-ND; Supplier Device Package: 1206; Tolerance: ±1%; Value: 1 kOhms
R64 R65 = RT1206FRE073K3L: RES SMD 3.3K OHM 1% 1/4W 1206; Manufacturer: Yageo; Power (Watts): 0.25W, 1/4W; Temperature Coefficient: ±50ppm/°C; Part Number: RT1206FRE073K3L; ComponentLink1Description: Datasheet; ComponentLink1URL: https://www.yageo.com/upload/media/product/productsearch/datasheet/rchip/PYu-RT_1-to-0.01_RoHS_L_12.pdf; ComponentLink2Description: DigiKey Link; ComponentLink2URL: https://www.digikey.com/en/products/detail/yageo/RT1206FRE073K3L/1083187; Composition: Thin Film; Device Package: 1206 (3216 Metric); Height - Seated (Max): 0.026" (0.65mm); LastUpdated: 7/25/2024 09:21:22; Lifecycle Status: Active; Minimum Order: 1; Number of Terminations: 2; Operating Temperature: -55°C ~ 155°C; Package / Case: 1206 (3216 Metric); Packaging: TapeAndReel; PartId: 58380; Price: 0.01; Resistance: 3.3 kOhms; Series: RT; Size / Dimension: 0.122" L x 0.063" W (3.10mm x 1.60mm); Supplier 1: DigiKey; Supplier Part Number 1: 13-RT1206FRE073K3LCT-ND; Supplier Device Package: 1206; Tolerance: ±1%; Value: 3.3 kOhms; Part Status: Active
U5 = TLV9362: TLV936x 10-MHz, 40-V, RRO, Operational Amplifie; ComponentLink1Description: Datasheet; ComponentLink1URL: https://www.ti.com/lit/ds/symlink/tlv9362.pdf
U6 = ADP7182: IC REG LIN NEG ADJ 200MA 5TSOT; Manufacturer: Analog Devices; Number Of Outputs: 1; Min Supply Voltage: -2.7V; Max Junction Temp: +125°C; Dropout Voltage: -185mV; Output Current: -200mA; Max Supply Voltage: -28V; Output Voltage: -1.22/-27.815V; Nominal Supply Current: -33/-650uA; Output Type: AdjustableProgrammable; Accuracy Percentage: 1%; RoHS: TRUE; Ambient Temperature Range Low: -40°C; Digikey Description: IC REG LIN NEG ADJ 200MA 5TSOT; Device Class L3: Voltage Regulators - Linear; Ambient Temperature Range High: +85°C; Manufacturer Part Number: ADP7182AUJZ-R7; ComponentLink2URL: https://www.analog.com/media/en/technical-documentation/data-sheets/ADP7182.pdf; Ipc Land Pattern Name: SOT95P280X100-5; Temperature Range Low: -40°C; ComponentLink2Description: Datasheet; Mouser Description: LDO Regulator Neg -1.22V to -27V 0.2A 5-Pin TSOT T/R; Category: IC; Automotive: No; Device Class L1: Integrated Circuits (ICs); Temperature: -40°C to +125°C; Octopart: https://octopart.com/adp7182aujz-r7-analog+devices-21054665; Device Class L2: Power Management ICs; Height: 1mm; Package: UJ-5; Temperature Range High: +125°C; Lead Free: Yes